# EAGLE schematic 9V Power Supply (EAGLE 7.4.0)
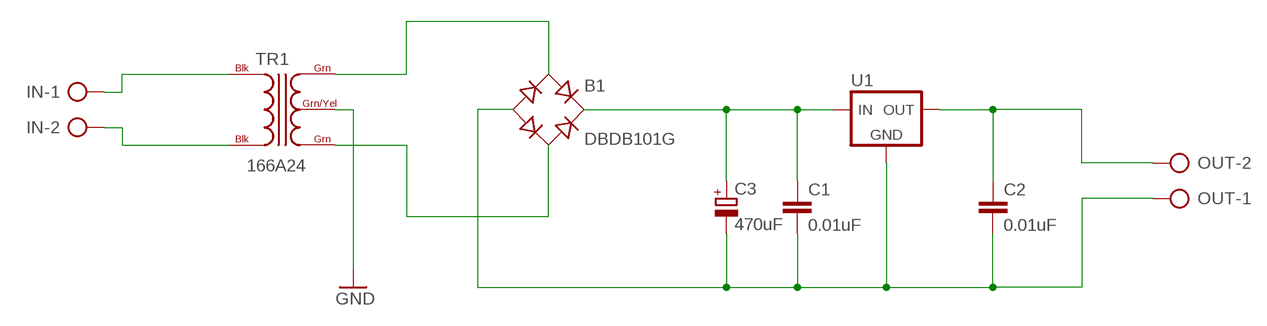
[diagram p0: schematic, sheet 1]

## Parts
B1  DBDB101G  [DB]
C1  0.01uF  C-EU025-030X050  [C025-030X050]
C2  0.01uF  C-EU025-030X050  [C025-030X050]
C3  470uF  CPOL-EUE2.5-7  [E2,5-7]
IN  AK300/2  [AK300/2]
OUT  AK300/2  [AK300/2]
TR1  166A24  [C2H]
U1  78XX-TO220H-NH  [TO220BH-NH]

## Nets
GND: B1.- C1.2 C2.2 C3.- OUT.1 TR1.GRN/YEL U1.2(GND)
N$1: IN.1 TR1.BLK@1(BLK)
N$2: IN.2 TR1.BLK@2(BLK)
N$3: B1.AC1 TR1.GRN@1(GRN)
N$4: B1.AC2 TR1.GRN@2(GRN)
N$5: B1.+ C1.1 C3.+ U1.1(VIN)
N$6: C2.1 OUT.2 U1.3(VOUT)

## Library data of the parts
B1 = rectifier:DB?*G: Single Phase 1.0 AMP Glass Passivated Bridge Rectifier Taiwan Semiconductor Co.,Ltd. - TSC Source: http://www.taiwansemi.com/TSCbig5/ezcatfiles/cust/img/img/db101g.pdf http://www.ts.com.tw/db/pictures/modules/PDT/PDT060207001/DBLS201G.pdf
C1 C2 = rcl:C-EU: CAPACITOR, European symbol
C3 = rcl:CPOL-EU: POLARIZED CAPACITOR, European symbol
IN OUT = con-ptr500:AK300/2: CONNECTOR; OC_FARNELL: unknown; OC_NEWARK: unknown
TR1 = trafo-hammondmfg:166: OPEN STYLE FILAMENT & L.V. RECTIFIER USE TRANSFORMERS Economical single primnary 115VAC, 60 Hz or 117 VAC 50/60 Hz Source: Data sheet <http://www.hammondmfg.com/166.htm>
U1 = bt_regulator:78XX: 78XX Linear Voltage Regulator The venerable 7800-series Linear Voltage Regulator, including 7805, 7809, 7812, 7815, 7862 in 5 V, 6.2 V, 8.2 V, 9 V, 12 V, and 15 V, respectively Datasheets TI_LM78L05.pdf <http://www.ti.com/lit/ds/symlink/lm78l05.pdf> Fairchild_LM7805.pdf <https://www.fairchildsemi.com/datasheets/LM/LM7805.pdf>